# Altium schematic sheet IntegracionModulo.SchDoc
size A4
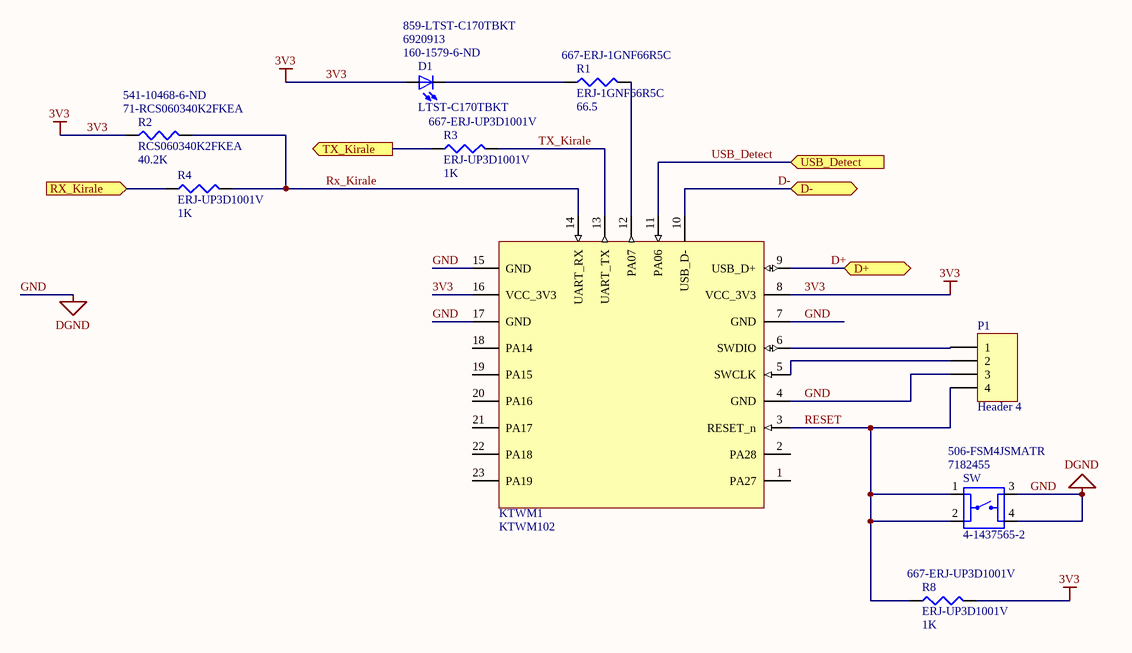
[diagram p0: IntegracionModulo.SchDoc]

## Parts
D1  LTST-C170TBKT  Supplier Part Number 1: 160-1579-6-ND  Supplier Part Number 2: 6920913  Supplier Part Number 3: 859-LTST-C170TBKT  [DIOC200X125X110]
KTWM1  KTWM102  [KTWM102]
P1  Header 4  [HDR1X4]
R1  ERJ-1GNF66R5C  value 66.5  Supplier Part Number 1: 667-ERJ-1GNF66R5C  [J1-0603]
R2  RCS060340K2FKEA  value 40.2K  Supplier Part Number 1: 71-RCS060340K2FKEA  Supplier Part Number 2: 541-10468-6-ND  [J1-0603]
R3  ERJ-UP3D1001V  value 1K  Supplier Part Number 1: 667-ERJ-UP3D1001V  [J1-0603]
R4  ERJ-UP3D1001V  value 1K  [J1-0603]
R8  ERJ-UP3D1001V  value 1K  Supplier Part Number 1: 667-ERJ-UP3D1001V  [J1-0603]
SW  4-1437565-2  Supplier Part Number 1: 7182455  Supplier Part Number 2: 506-FSM4JSMATR  [SW_4-1437565-2]

## Ports
D+ (bidir), D- (bidir), RX_Kirale (in), TX_Kirale (out), USB_Detect (in)

## Nets
3V3: D1.POS KTWM1.8(VCC_3V3) KTWM1.16(VCC_3V3) R2.1 R8.2
GND: KTWM1.4(GND) KTWM1.7(GND) KTWM1.15(GND) KTWM1.17(GND) P1.3 SW.3 SW.4  [also labelled DGND]
D+: KTWM1.9(USB_D+) ; port D+
D-: KTWM1.10(USB_D-) ; port D-
RESET: KTWM1.3(RESET_n) P1.4 R8.1 SW.1 SW.2
Rx_Kirale: KTWM1.14(UART_RX) R2.2 R4.2
RX_Kirale: R4.1 ; port RX_Kirale  [a separate net that carries the same name]
TX_Kirale: KTWM1.13(UART_TX) R3.2
TX_Kirale: R3.1 ; port TX_Kirale  [a separate net that carries the same name]
USB_Detect: KTWM1.11(PA06) ; port USB_Detect
NetD1_NEG: D1.NEG R1.1
NetKTWM1_5: KTWM1.5(SWCLK) P1.2
NetKTWM1_6: KTWM1.6(SWDIO) P1.1
NetKTWM1_12: KTWM1.12(PA07) R1.2

Not connected (* = marked no-connect by the designer): KTWM1 1(PA27) 2(PA28) 18(PA14) 19(PA15) 20(PA16) 21(PA17) 22(PA18) 23(PA19)

## Library data of the parts
D1 = LTST-C170TBKT: Blue 470nm LED Indication - Discrete 3.3V 0805 _2012 Metric_; MF: Lite-On Inc.; SnapEDA_Link: https://www.snapeda.com/parts/LTST-C170TBKT/Lite-On%20Inc./view-part/217848/?ref=snap; MP: LTST-C170TBKT; Value: *; Digi-Key_Part_Number: 160-1579-1-ND; Digi-Key_Purchase_URL: https://www.digikey.jp/product-detail/en/lite-on-inc/LTST-C170TBKT/160-1579-1-ND/564889?utm_source=snapeda&utm_medium=aggregator&utm_campaign=symbol; Package: 0805 Lite-On; Supplier 1: Digi-Key; Supplier 2: RSComponents; Supplier 3: Mouser
KTWM1 = KTWM102: https://www.kirale.com/products/ktwm102/
P1 = Header 4: Header, 4-Pin; LatestRevisionDate: 17-Jul-2002; LatestRevisionNote: Re-released for DXP Platform.; Publisher: Altium Limited
R1-R4 R8 = Res3: Resistor; Published: 8-Jun-2000; LatestRevisionDate: 29-May-2009; LatestRevisionNote: IPC-7351 Footprint Added.; PackageReference: J1-0603; Publisher: Altium Limited; PackageDescription: Chip Resistor; Supplier 1: Mouser
  R2: Supplier 2: Digi-Key
SW = 4-1437565-2: Switch Tactile OFF _ON_ SPST Round Button Gull Wing 0.05A 24VDC 1VA 9.18N SMD T/R; MF: TE Connectivity; MP: FSM4JSMATR; Package: None; Price: None; TE_purchase_URL: https://www.te.com/usa-en/product-4-1437565-2.html?te_bu=Cor&te_type=disp&te_campaign=seda_glo_cor-seda-global-disp-prtnr-fy19-seda-model-bom-cta_sma-317_1&elqCampaignId=32493; SnapEDA_Link: https://www.snapeda.com/parts/FSM4JSMATR/TE%20Connectivity%20ALCOSWITCH%20Switches/view-part/2774279/?ref=snap; Availability: Unavailable; Value: *; Supplier 1: RSComponents; Supplier 2: Mouser